# Altium project PCB_RX_V2.7.PrjPcb
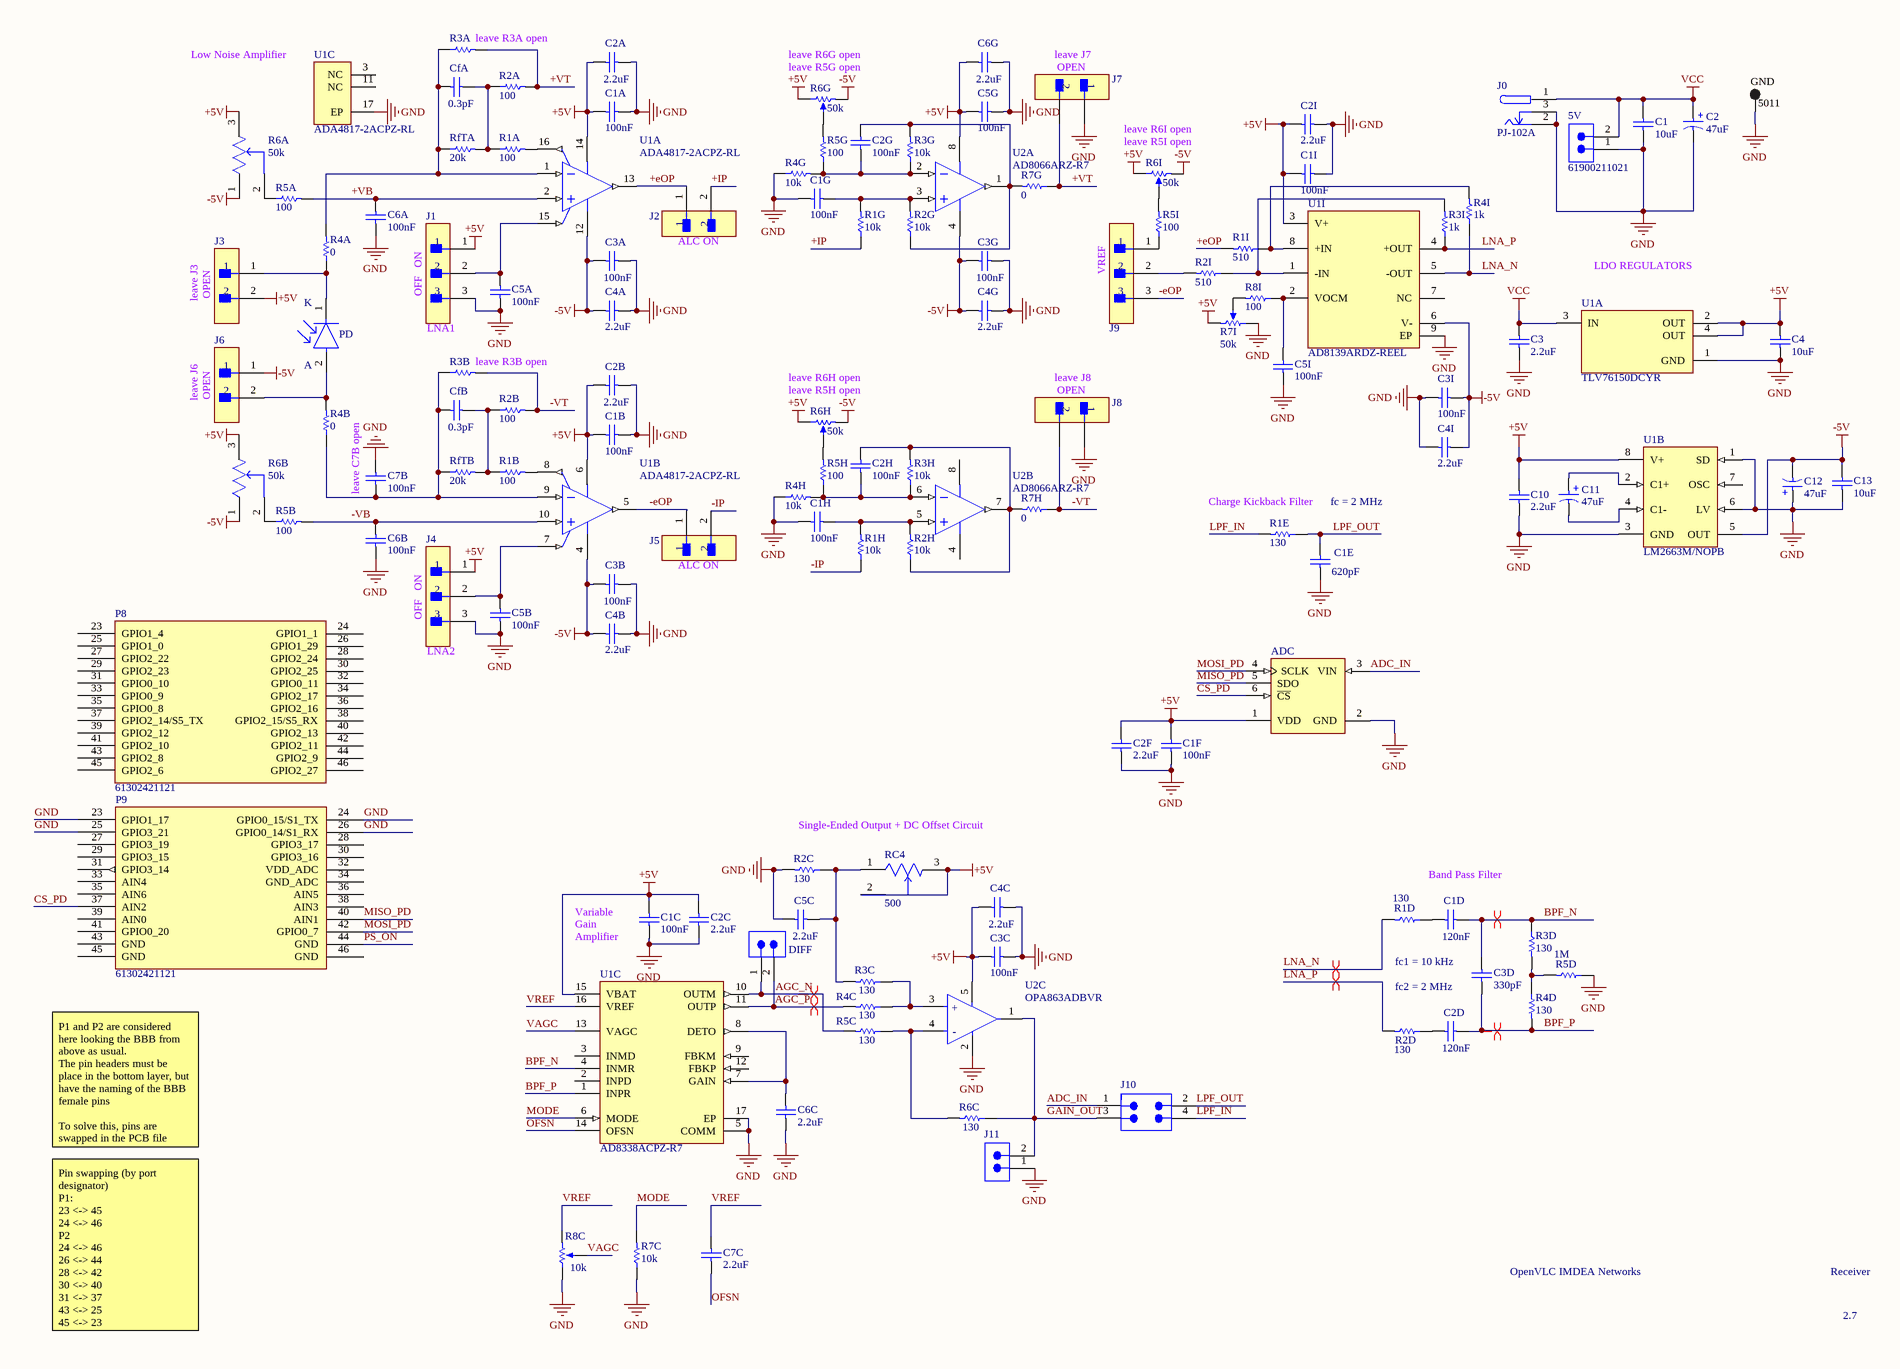
[diagram p0: PCB_RX.SchDoc, left]
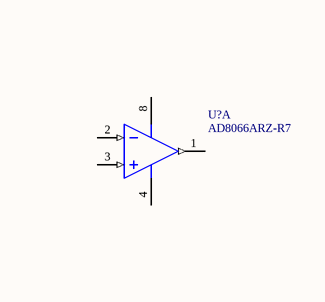
[diagram p1: PCB_RX.SchDoc, right]
1 sheet, 126 parts. Net scope: global (net labels, ports and power ports of the same name join across sheets).
Board file: PCB_RX.PcbDoc

## Sheet PCB_RX.SchDoc
size A3; SheetNumber: 1; SheetTotal: 1

### Parts
5V  61900211021  [61900211021]
ADC  ADS7886SBDBVR  [TI-DBV6_M]  (value not drawn)
C1  value 10uF  [RESC1608X55N]  (hidden comment: Cap)
C1A  value 100nF  [RESC1608X55N]  (hidden comment: Cap)
C1B  value 100nF  [RESC1608X55N]  (hidden comment: Cap)
C1C  value 100nF  [RESC1608X55N]  (hidden comment: Cap)
C1D  value 120nF  [RESC1608X55N]  (hidden comment: Cap)
C1E  value 620pF  [RESC1608X55N]  (hidden comment: Cap)
C1F  value 100nF  [RESC1608X55N]  (hidden comment: Cap)
C1G  value 100nF  [RESC1608X55N]  (hidden comment: Cap)
C1H  value 100nF  [RESC1608X55N]  (hidden comment: Cap)
C1I  value 100nF  [RESC1608X55N]  (hidden comment: Cap)
C2  47uF  [WCAP-PSLP_D5H5.5]
C2A  value 2.2uF  [RESC1608X55N]  (hidden comment: Cap)
C2B  value 2.2uF  [RESC1608X55N]  (hidden comment: Cap)
C2C  value 2.2uF  [RESC1608X55N]  (hidden comment: Cap)
C2D  value 120nF  [RESC1608X55N]  (hidden comment: Cap)
C2F  value 2.2uF  [RESC1608X55N]  (hidden comment: Cap)
C2G  value 100nF  [RESC1608X55N]  (hidden comment: Cap)
C2H  value 100nF  [RESC1608X55N]  (hidden comment: Cap)
C2I  value 2.2uF  [RESC1608X55N]  (hidden comment: Cap)
C3  value 2.2uF  [RESC1608X55N]  (hidden comment: Cap)
C3A  value 100nF  [RESC1608X55N]  (hidden comment: Cap)
C3B  value 100nF  [RESC1608X55N]  (hidden comment: Cap)
C3C  value 100nF  [RESC1608X55N]  (hidden comment: Cap)
C3D  value 330pF  [RESC1608X55N]  (hidden comment: Cap)
C3G  value 100nF  [RESC1608X55N]  (hidden comment: Cap)
C3I  value 100nF  [RESC1608X55N]  (hidden comment: Cap)
C4  value 10uF  [RESC1608X55N]  (hidden comment: Cap)
C4A  value 2.2uF  [RESC1608X55N]  (hidden comment: Cap)
C4B  value 2.2uF  [RESC1608X55N]  (hidden comment: Cap)
C4C  value 2.2uF  [RESC1608X55N]  (hidden comment: Cap)
C4G  value 2.2uF  [RESC1608X55N]  (hidden comment: Cap)
C4I  value 2.2uF  [RESC1608X55N]  (hidden comment: Cap)
C5A  value 100nF  [RESC1608X55N]  (hidden comment: Cap)
C5B  value 100nF  [RESC1608X55N]  (hidden comment: Cap)
C5C  value 2.2uF  [RESC1608X55N]  (hidden comment: Cap)
C5G  value 100nF  [RESC1608X55N]  (hidden comment: Cap)
C5I  value 100nF  [RESC1608X55N]  (hidden comment: Cap)
C6A  value 100nF  [RESC1608X55N]  (hidden comment: Cap)
C6B  value 100nF  [RESC1608X55N]  (hidden comment: Cap)
C6C  value 2.2uF  [RESC1608X55N]  (hidden comment: Cap)
C6G  value 2.2uF  [RESC1608X55N]  (hidden comment: Cap)
C7B  value 100nF  [RESC1608X55N]  (hidden comment: Cap)
C7C  value 2.2uF  [RESC1608X55N]  (hidden comment: Cap)
C10  value 2.2uF  [RESC1608X55N]  (hidden comment: Cap)
C11  47uF  [WCAP-PSLP_D5H5.5]
C12  47uF  [WCAP-PSLP_D5H5.5]
C13  value 10uF  [RESC1608X55N]  (hidden comment: Cap)
CfA  value 0.3pF  [RESC1608X55N]  (hidden comment: Cap)
CfB  value 0.3pF  [RESC1608X55N]  (hidden comment: Cap)
DIFF  61300211121  [61300211121]  (value not drawn)
GND  5011  [KSTN-5011_V]
J0  PJ-102A  [FP-PJ-102A-MFG]
J1  GRPB031VWVN-RC  [FP-TMS-103-02-G-S-MFG]  (value not drawn)
J2  GRPB021VWVN-RC  [FP-GRPB021VWVN-RC-MFG]  (value not drawn)
J3  GRPB021VWVN-RC  [FP-GRPB021VWVN-RC-MFG]  (value not drawn)
J4  GRPB031VWVN-RC  [FP-TMS-103-02-G-S-MFG]  (value not drawn)
J5  GRPB021VWVN-RC  [FP-GRPB021VWVN-RC-MFG]  (value not drawn)
J6  GRPB021VWVN-RC  [FP-GRPB021VWVN-RC-MFG]  (value not drawn)
J7  GRPB021VWVN-RC  [FP-GRPB021VWVN-RC-MFG]  (value not drawn)
J8  GRPB021VWVN-RC  [FP-GRPB021VWVN-RC-MFG]  (value not drawn)
J9  GRPB031VWVN-RC  [FP-TMS-103-02-G-S-MFG]  (value not drawn)
J10  61300421121  [61300421121]  (value not drawn)
J11  61900211121  [61900211121]  (value not drawn)
P8  61302421121  [BBB_CAPE_NO_HEADER_R_24]
P9  61302421121  [BBB_CAPE_NO_HEADER_R_24]
PD  SFH213  [FP-SFH213-0]  (value not drawn)
R1A  value 100  [RESC1608X55N]  (hidden comment: Res1)
R1B  value 100  [RESC1608X55N]  (hidden comment: Res1)
R1D  value 130  [RESC1608X55N]  (hidden comment: Res1)
R1E  value 130  [RESC1608X55N]  (hidden comment: Res1)
R1G  value 10k  [RESC1608X55N]  (hidden comment: Res1)
R1H  value 10k  [RESC1608X55N]  (hidden comment: Res1)
R1I  value 510  [RESC1608X55N]  (hidden comment: Res1)
R2A  value 100  [RESC1608X55N]  (hidden comment: Res1)
R2B  value 100  [RESC1608X55N]  (hidden comment: Res1)
R2C  value 130  [RESC1608X55N]  (hidden comment: Res1)
R2D  value 130  [RESC1608X55N]  (hidden comment: Res1)
R2G  value 10k  [RESC1608X55N]  (hidden comment: Res1)
R2H  value 10k  [RESC1608X55N]  (hidden comment: Res1)
R2I  value 510  [RESC1608X55N]  (hidden comment: Res1)
R3A  Res1  [RESC1608X55N]  (value not drawn)
R3B  Res1  [RESC1608X55N]  (value not drawn)
R3C  value 130  [RESC1608X55N]  (hidden comment: Res1)
R3D  value 130  [RESC1608X55N]  (hidden comment: 500)
R3G  value 10k  [RESC1608X55N]  (hidden comment: Res1)
R3H  value 10k  [RESC1608X55N]  (hidden comment: Res1)
R3I  value 1k  [RESC1608X55N]  (hidden comment: Res1)
R4A  value 0  [RESC1608X55N]  (hidden comment: Res1)
R4B  value 0  [RESC1608X55N]  (hidden comment: Res1)
R4C  value 130  [RESC1608X55N]  (hidden comment: Res1)
R4D  value 130  [RESC1608X55N]  (hidden comment: Res1)
R4G  value 10k  [RESC1608X55N]  (hidden comment: Res1)
R4H  value 10k  [RESC1608X55N]  (hidden comment: Res1)
R4I  value 1k  [RESC1608X55N]  (hidden comment: Res1)
R5A  value 100  [RESC1608X55N]  (hidden comment: Res1)
R5B  value 100  [RESC1608X55N]  (hidden comment: Res1)
R5C  value 130  [RESC1608X55N]  (hidden comment: Res1)
R5D  value 1M  [RESC1608X55N]  (hidden comment: Res1)
R5G  value 100  [RESC1608X55N]  (hidden comment: Res1)
R5H  value 100  [RESC1608X55N]  (hidden comment: Res1)
R5I  value 100  [RESC1608X55N]  (hidden comment: Res1)
R6A  50k  [FP-3296W-MFG]
R6B  50k  [FP-3296W-MFG]
R6C  value 130  [RESC1608X55N]  (hidden comment: Res1)
R6G  50k  [BOUR-3362P]
R6H  50k  [BOUR-3362P]
R6I  50k  [BOUR-3362P]
R7C  value 10k  [RESC1608X55N]  (hidden comment: Res1)
R7G  value 0  [RESC1608X55N]  (hidden comment: Res1)
R7H  value 0  [RESC1608X55N]  (hidden comment: Res1)
R7I  50k  [BOUR-3362P]
R8C  10k  [BOUR-3362P]
R8I  value 100  [RESC1608X55N]  (hidden comment: Res1)
RC4  500  [FP-3296W-MFG]
RfTA  value 20k  [RESC1608X55N]  (hidden comment: Res1)
RfTB  value 20k  [RESC1608X55N]  (hidden comment: Res1)
U1  ADA4817-2ACPZ-RL  [CP-16-4_N]  (parts A,B,C of 3)
U1A  TLV76150DCYR  [FP-DCY0004A-MFG]
U1B  LM2663M/NOPB  [D0008A_N]
U1C  AD8338ACPZ-R7  [FP-CP-16-22-IPC_A]
U1I  AD8139ARDZ-REEL  [FP-RD-8-1-IPC_C]
U2  AD8066ARZ-R7  [ADI-R-8_M]  (parts A,B of 2)
U2C  OPA863ADBVR  [FP-DBV0005A-MFG]
U?  AD8066ARZ-R7  [ADI-R-8_M]  (part A of 2)

### Nets
+5V: ADC.1(VDD) C1A.1 C1B.1 C1C.1 C1F.1 C1I.1 C2A.1 C2B.1 C2C.1 C2F.1 C2I.1 C3C.1 C4.2 C4C.1 C5G.1 C6G.1 C10.2 J1.1 J3.2 J4.1 R6A.3(CW) R6B.3(CW) R6G.1(CCW) R6H.1(CCW) R6I.1(CCW) R7I.3(CW) RC4.2(WIPER) RC4.3(CW) U1.6(+VS_2) U1.14(+VS_1) U1A.2(OUT) U1A.4(OUT) U1B.8(V+) U1C.15(VBAT) U1I.3(V+) U2.8(+VS) U2C.5(VS+)
-5V: C3A.1 C3B.1 C3G.1 C3I.2 C4A.1 C4B.1 C4G.1 C4I.2 C12.2(N) C13.2 J6.1 R6A.1(CCW) R6B.1(CCW) R6G.3(CW) R6H.3(CW) R6I.3(CW) U1.4(-VS_2) U1.12(-VS_1) U1B.5(OUT) U1I.6(V-) U2.4(-VS)
GND: 5V.1 ADC.2(GND) C1.2 C1A.2 C1B.2 C1C.2 C1E.2 C1F.2 C1G.1 C1H.1 C1I.2 C2.2(N) C2A.2 C2B.2 C2C.2 C2F.2 C2I.2 C3.1 C3A.2 C3B.2 C3C.2 C3G.2 C3I.1 C4.1 C4A.2 C4B.2 C4C.2 C4G.2 C4I.1 C5A.2 C5B.2 C5C.1 C5G.2 C5I.2 C6A.2 C6B.2 C6C.1 C6G.2 C7B.2 C10.1 C12.1(P) C13.1 GND.1 J0.2 J0.3 J1.3 J4.3 J7.1 J8.1 J11.1 P9.23(GPIO1_17) P9.24(GPIO0_15/S1_TX) P9.25(GPIO3_21) P9.26(GPIO0_14/S1_RX) R2C.2 R4G.1 R4H.1 R5D.1 R7C.1 R7I.1(CCW) R8C.1(CCW) U1A.1(GND) U1B.1(SD) U1B.3(GND) U1B.6(LV) U1C.5(COMM) U1C.17(EP) U1I.9(EP) U2C.2(VS-)
VCC: 5V.2 C1.1 C2.1(P) C3.2 J0.1 U1A.3(IN)
+eOP: J2.1 R1I.2 U1.13(OUT_1)
+IP: J2.2 R1G.1
+VB: C6A.1 R5A.2 U1.2(+IN_1)
+VT: J7.2 R2A.2 R3A.2 R7G.1
-eOP: J5.1 J9.3 U1.5(OUT_2)
-IP: J5.2 R1H.1
-VB: C6B.1 R5B.2 U1.10(+IN_2)
-VT: J8.2 R2B.2 R3B.2 R7H.1
ADC_IN: ADC.3(VIN) J10.1
AGC_N: DIFF.1 R5C.2 U1C.10(OUTM)
AGC_P: DIFF.2 R4C.2 U1C.11(OUTP)
BPF_N: C1D.2 C3D.2 R3D.1 U1C.4(INMR)
BPF_P: C2D.2 C3D.1 R4D.2 U1C.1(INPR)
CS_PD: ADC.6(~{CS}) P9.37(AIN2)
GAIN_OUT: J10.3 J11.2 R6C.1 U2C.1(VOUT)
LNA_N: R1D.2 R4I.1 U1I.5(-OUT)
LNA_P: R2D.2 R3I.1 U1I.4(+OUT)
LPF_IN: J10.4 R1E.2
LPF_OUT: C1E.1 J10.2 R1E.1
MISO_PD: ADC.5(SDO) P9.40(AIN1)
MODE: R7C.2 U1C.6(MODE)
MOSI_PD: ADC.4(SCLK) P9.42(GPIO0_7)
OFSN: C7C.1 U1C.14(OFSN)
PS_ON: P9.44(GND)
VAGC: R8C.2(S) U1C.13(VAGC)
VREF: C7C.2 R8C.3(CW) U1C.16(VREF)
NetC1D_1: C1D.1 R1D.1
NetC1G_2: C1G.2 R1G.2 R2G.2 U2.3(+IN_1)
NetC1H_2: C1H.2 R1H.2 R2H.2 U2.5(+IN_2)
NetC2D_1: C2D.1 R2D.1
NetC2G_1: C2G.1 R3G.1 R4G.2 R5G.1 U2.2(-IN_1)
NetC2G_2: C2G.2 R2G.1 R3G.2 R7G.2 U2.1(VOUT_1)
NetC2H_1: C2H.1 R3H.1 R4H.2 R5H.1 U2.6(-IN_2)
NetC2H_2: C2H.2 R2H.1 R3H.2 R7H.2 U2.7(VOUT_2)
NetC5A_1: C5A.1 J1.2 U1.15(~{PD1})
NetC5B_1: C5B.1 J4.2 U1.7(~{PD2})
NetC5C_2: C5C.2 R2C.1 R3C.2 RC4.1(CCW)
NetC5I_1: C5I.1 R8I.1 U1I.2(VOCM)
NetC6C_2: C6C.2 U1C.7(GAIN) U1C.8(DETO)
NetC7B_1: C7B.1 CfB.1 R3B.1 R4B.1 RfTB.1 U1.9(-IN_2)
NetC11_1: C11.1(P) U1B.2(C1+)
NetC11_2: C11.2(N) U1B.4(C1-)
NetCfA_1: CfA.1 R3A.1 R4A.2 RfTA.1 U1.1(-IN_1)
NetCfA_2: CfA.2 R1A.1 R2A.1 RfTA.2
NetCfB_2: CfB.2 R1B.1 R2B.1 RfTB.2
NetJ3_1: J3.1 PD.1(C) R4A.1
NetJ6_2: J6.2 PD.2(A) R4B.2
NetJ9_1: J9.1 R5I.1
NetJ9_2: J9.2 R2I.2
NetR1A_2: R1A.2 U1.16(FB1)
NetR1B_2: R1B.2 U1.8(FB2)
NetR1I_1: R1I.1 R4I.2 U1I.8(+IN)
NetR2I_1: R2I.1 R3I.2 U1I.1(-IN)
NetR3C_1: R3C.1 R4C.1 U2C.3(VIN+)
NetR3D_2: R3D.2 R4D.1 R5D.2
NetR5A_1: R5A.1 R6A.2(WIPER)
NetR5B_1: R5B.1 R6B.2(WIPER)
NetR5C_1: R5C.1 R6C.2 U2C.4(VIN-)
NetR5G_2: R5G.2 R6G.2(S)
NetR5H_2: R5H.2 R6H.2(S)
NetR5I_2: R5I.2 R6I.2(S)
NetR7I_2: R7I.2(S) R8I.2

Not connected (* = marked no-connect by the designer): P8 23(GPIO1_4) 24(GPIO1_1) 25(GPIO1_0) 26(GPIO1_29) 27(GPIO2_22) 28(GPIO2_24) 29(GPIO2_23) 30(GPIO2_25) 31(GPIO0_10) 32(GPIO0_11) 33(GPIO0_9) 34(GPIO2_17) 35(GPIO0_8) 36(GPIO2_16) 37(GPIO2_14/S5_TX) 38(GPIO2_15/S5_RX) 39(GPIO2_12) 40(GPIO2_13) 41(GPIO2_10) 42(GPIO2_11) 43(GPIO2_8) 44(GPIO2_9) 45(GPIO2_6) 46(GPIO2_27); P9 27(GPIO3_19) 28(GPIO3_17) 29(GPIO3_15) 30(GPIO3_16) 31(GPIO3_14) 32(VDD_ADC) 33(AIN4) 34(GND_ADC) 35(AIN6) 36(AIN5) 38(AIN3) 39(AIN0) 41(GPIO0_20) 43(GND) 45(GND) 46(GND); U1 3(NC) 11(NC) 17(EP); U1B 7(OSC); U1C 2(INPD) 3(INMD) 9(FBKM) 12(FBKP); U1I 7(NC); U? 1(VOUT_1) 2(-IN_1) 3(+IN_1) 4(-VS) 8(+VS)

### Layout directives
differential pair: AGC_N, AGC_P, BPF_N, BPF_P, LNA_N, LNA_P

### Notes on the sheet
- Low Noise Amplifier
- (near R3A) leave R3A open
- (near R6G) leave R5G open
- (near R6G) leave R6G open
- (near J7) leave J7
- (near J7) OPEN
- (near R6I) leave R5I open
- leave R6I open
- (near J1) ON
- (near J2) ALC ON
- (near J9) VREF
- LDO REGULATORS
- (near J3) leave J3
- (near J3) OPEN
- (near PD) K
- (near J1) OFF
- LNA1
- (near J6) leave J6
- (near J6) OPEN
- (near PD) A
- (near R3B) leave R3B open
- (near R6H) leave R5H open
- (near R6H) leave R6H open
- (near J8) leave J8
- (near J8) OPEN
- (near C7B) leave C7B open
- (near R1E) Charge Kickback Filter
- fc = 2 MHz
- (near J4) ON
- (near J5) ALC ON
- (near J4) OFF
- (near J4) LNA2
- Single-Ended Output + DC Offset Circuit
- Band Pass Filter
- (near C1C) Amplifier
- Gain
- (near C1C) Variable
- (near C3D) fc1 = 10 kHz
- fc2 = 2 MHz
- P1 and P2 are considered here looking the BBB from above as usual.
  The pin headers must be place in the bottom layer, but have the naming of the BBB female pins
  To solve this, pins are swapped in the PCB file
- OpenVLC IMDEA Networks
- Receiver
- Pin swapping (by port designator)
  P1:
  23 <-> 45
  24 <-> 46
  P2
  24 <-> 46
  26 <-> 44
  28 <-> 42
  30 <-> 40
  31 <-> 37
  43 <-> 25
  45 <-> 23
- 2.7
- Labels drawn without touching a wire or pin: GND
- (in symbol CMP-00370-145533195-1) +; -
- (in symbol CMP-03913-53758736-1) +

### Library data of the parts
5V = CMP-1502-00592-2: NexarPartId: 18818217; Gender: Male; Insulation Resistance: 1GΩ; Voltage Rating: 250V; Contact Resistance: 20mΩ; Connector Type: Male Pin; Number of Positions: 2; Insulation: Insulated; Current Rating: 3A; Pitch: 2.54mm; Contact Mating Length: 7.62mm; Packaging: Bulk; Contact Plating: Tin; REACH SVHC: Unknown; Height: 3.2mm; Lead Pitch: 2.54mm; Color: Beige; Flammability Rating: UL94 V-0; RoHS: Compliant; Operating Supply Voltage: 250V; Length: 5.08mm; Number of Pins: 2; Max Operating Temperature: 105°C; Number of Rows: 1; Min Operating Temperature: -40°C; Contact Material: Copper; Mount: Through Hole; Housing Material: Nylon; Width: 5.12mm; Fastening Type: Friction; Contact Gender: Male; Number of Contacts: 2; Termination: Through Hole
ADC = CMP-0003-00246-2: 2.35 to 5.25 V, 12-Bit, 1 MSPS, Serial ADC, -40 to 125 degC, 6-pin SOT23 (DBV6), Green (RoHS & no Sb/Br); Manufacturer: Texas Instruments; Sample Rate (max)(SPS): 1M; INL(Max)(+/-LSB): 1.25; Digital Supply(Min)(V): 2.35; SNR(dB): 71.25; Interface: Serial SPI; Resolution(Bits): 12; SubFamily: Precision ADC (<=10MSPS); # Input Channels: 1; Digital Supply(Max)(V): 5.25; SFDR(dB): 85.5; Architecture: SAR; PackageDescription: 6-Pin Plastic Small Outline, Body 1.6 x 2.9 mm, Pitch 0.95 mm; ComponentLink1URL: http://www.ti.com/; PackageReference: DBV6; PartNumber: ADS7886SBDBVR; ComponentLink1Description: Manufacturer URL; ComponentLink2Description: Datasheet; Code_JEDEC: MO-178; ComponentLink3URL: http://www.ti.com/litv/pdf/mpds026h; ComponentLink2URL: http://www.ti.com/general/docs/lit/getliterature.tsp?genericPartNumber=ADS7886&fileType=pdf; ComponentLink3Description: Package Specification; Eco-Plan: Green (RoHS & no Sb/Br); Analog Voltage AV/DD(Min)(V): 2.35; DatasheetVersion: SLAS492A; SINAD(dB): 71.25; Mounting Technology: Surface Mount; PackageVersion: 4073253-5/K, 03/2006; Analog Voltage AV/DD(Max)(V): 5.25
C1 C1A C1B C1C C1D C1E C1F C1G C1H C1I C2A C2B C2C C2D C2F C2G C2H C2I C3 C3A C3B C3C C3D C3G C3I C4 C4A C4B C4C C4G C4I C5A C5B C5C C5G C5I C6A C6B C6C C6G C7B C7C C10 C13 CfA CfB = Cap: Capacitor; Published: 8-Jun-2000; LatestRevisionDate: 17-Jul-2002; LatestRevisionNote: Re-released for DXP Platform.; PackageReference: RAD-0.3; Publisher: Altium Limited; PackageDescription: Radial Cap, Thru-Hole; 2 Leads; 0.3 in Pin Spacing
C2 C11 C12 = CMP-03913-53758736-1: 875105242006 WCAP-PSLP Aluminum Polymer Capacitors; Voltage Rating (DC): 10V; Life (Hours): 2000hours; ESR (Equivalent Series Resistance): 30mΩ; Ripple Current: 1.97A; Leakage Current: 300µA; Capacitance: 47µF; Polarity: Polar; Pitch: 5.3mm; Tolerance: 20%; Diameter: 5mm; Length: 5.5mm; RoHS: Compliant; Packaging: Tape & Reel (TR); Case/Package: Radial; REACH SVHC: Unknown; Max Operating Temperature: 105°C; Min Operating Temperature: -55°C; Mount: Surface Mount; Voltage Rating: 10V; Height - Seated (Max): 5.5118mm; NexarPartId: 53758736
DIFF = CMP-1712-00002-6: NexarPartId: 20081794; Number of Contacts: 2; Pitch: 2.54mm; Connector Type: Male Pin; Voltage Rating: 250V; Current Rating: 3A; Gender: Male; Contact Resistance: 20mΩ; Height: 8.94mm; Lead Free: Lead Free; Number of Pins: 2; Termination: Through Hole; RoHS: Compliant; Lead Pitch: 2.54mm; REACH SVHC: No SVHC; Housing Material: PBT; Contact Mating Length: 5.9944mm; Min Operating Temperature: -40°C; Orientation: Vertical; Contact Material: Copper; Contact Gender: Male; Max Operating Temperature: 125°C; Number of Rows: 1; Number of Positions: 2; Packaging: Bulk; Contact Plating: Gold; Mount: Through Hole; Color: Black; Operating Supply Voltage: 250V
GND = CMP-1672-00003-4: Test Point, Black, Through Hole, RoHS, Bulk; Manufacturer: Keystone; ComponentLink2URL: http://www.keyelco.com/product-pdf.cfm?p=1320; Colour: Black; Pins: 1; REACH SVHC: No SVHC; ComponentLink1URL: http://www.keyelco.com/; PackageReference: 5011; Contact Plating: Silver; Package Quantity: 100; Packaging: Bulk; RoHSCompliant: true; Height: 8.12 mm; PackageDescription: 1-Pin Through Hole Device, Dia 3.17 mm; Mount: Through Hole; Mounting Technology: Through Hole; DatasheetVersion: Rev. F, 12/2013; ComponentLink1Description: Manufacturer URL; Contact Material: Bronze; ComponentLink2Description: Datasheet
J0 = CMP-12637-106234071-1: PJ-102A 2.0 x 6.5 mm, 2.5 A, Horizontal, Through Hole, Tapered Pins, Dc Power Jack Connector; Voltage Rating (DC): 24V; Number of Contacts: 3; Outside Diameter: 6.5mm; Gender: Male; Shielding: No; Insulation Resistance: 50MΩ; Current Rating: 2.5A; Inside Diameter: 2mm; Number of Conductors: 2; Housing Color: Black; RoHS: Compliant; Diameter: 2.1mm; Mount: Through Hole; Contact Plating: Nickel; NexarPartId: 106234071; Voltage Rating: 24V; Housing Material: Thermoplastic; Max Operating Temperature: 85°C; Color: Black; Contact Material: Copper, Nickel, Tin; Orientation: Horizontal; Packaging: Bulk; Flammability Rating: UL94 V-0; Schedule B: 8536695050, 8536695050; Contact Gender: Male; Lead Free: Lead Free; Termination: Through Hole; Min Operating Temperature: -25°C; Height: 11.2mm; Lifecycle Status: Production
J1 J4 J9 = CMP-02766-001782-1: CONN HEADER VERT 3POS 1.27MM; Number of Positions: 3; Max Current Rating: 1A; Gender: Male; Min Operating Temperature: -55°C; Housing Material: Polymer; Reach SVHC Compliant: Yes; Length: 3.81mm; Contact Material: Bronze; Series: TMS; Packaging: Bulk; Radiation Hardening: No; Insulation Material: Polymer; Contact Type: Male Pin; Orientation: Straight; Housing Color: Black; Contact Finish - Mating: GOLD; Contact Plating: Gold; Flammability Rating: UL94 V-0; Contact Shape: Square; Depth: 2.48mm; Pitch: 1.27mm; Fastening Type: Pull; RoHS Compliant: Yes; Termination: Solder; Number of Rows: 1; Insulation Color: Black; Number of Contacts: 3; Connector Type: Header; Max Operating Temperature: 125°C
J2 J3 J5-J8 = CMP-2000-06371-2: CONN HEADER VERT 2POS 1.27MM; Number of Positions: 2; Connector Type: Male Pin; Pitch: 0.05inch; Contact Plating: Gold; Lead Free: Lead Free; Termination: Solder; Packaging: Bulk; RoHS Compliant: Yes; Contact Type: Male Pin; Mount: Through Hole; Number of Rows: 1; Contact Mating Length: 0.118inch; Package Quantity: 1
J10 = CMP-1502-01066-4: NexarPartId: 32855524; Number of Positions: 4; Operating Supply Voltage: 250V; Pitch: 2.54mm; Connector Type: Male Pin; Current Rating: 3A; Contact Resistance: 20mΩ; Gender: Male; Number of Pins: 4; Max Operating Temperature: 105°C; Number of Contacts: 4; Contact Mating Length: 5.9944mm; Min Operating Temperature: -40°C; Orientation: Vertical; Height: 8.89mm; Mount: Through Hole; Lead Pitch: 2.54mm; Contact Material: Copper; Color: Black; Voltage Rating: 250V; RoHS: Compliant; Termination: Solder; Row Spacing: 2.54mm; Contact Plating: Gold; Number of Rows: 2; Lead Free: Lead Free; REACH SVHC: Unknown; Packaging: Bulk
J11 = CMP-1502-00584-3: NexarPartId: 18818218; Gender: Male; Connector Type: Male Pin; Insulation Resistance: 1GΩ; Contact Resistance: 20mΩ; Number of Contacts: 2; Operating Supply Voltage: 250V; Current Rating: 3A; Pitch: 2.54mm; Color: Beige; Fastening Type: Friction; Number of Pins: 2; Lead Pitch: 2.54mm; Orientation: Vertical; Max Operating Temperature: 105°C; Contact Mating Length: 7.493mm; RoHS: Compliant; Voltage Rating: 250V; Number of Positions: 2; Mount: Through Hole; Length: 5.08mm; Contact Plating: Tin; Width: 5.12mm; Termination: Through Hole; Flammability Rating: UL94 V-0; Min Operating Temperature: -40°C; Housing Material: Nylon; Contact Gender: Male; Number of Rows: 1; Packaging: Bulk; REACH SVHC: Unknown; Contact Material: Copper; Height: 11.75mm
P8 = BBB_P8_reduced
P9 = BBB_P9_reduced
PD = CMP-62027-000002-1: SENSOR PHOTODIODE 850NM RADIAL; Manufacturer: OSRAM; Reverse Breakdown Voltage: 20V; Dark Current: 0.001uA; Wavelength: 400-1100nm; Forward Voltage: 1.3V; Forward Current: 100mA; Voltage: 50V; Power Dissipation: 150mW; Category: Diode; Temperature Range High: +100°C; Digikey Description: SENSOR PHOTODIODE 850NM RADIAL; Lead Free: Yes; Automotive: No; Temperature: -40°C to +100°C; Device Class L1: Sensors; Package: SFH213; Device Class L3: Photodiodes; Mouser Description: Photodiode PIN Chip 850nm 0.62A/W Sensitivity 2-Pin T-1 3/4 T/R; Manufacturer Part Number: SFH213; Ipc Land Pattern Name: CAPRD254W95D570H860; Temperature Range Low: -40°C; Device Class L2: Optical Sensors; ComponentLink2URL: https://dammedia.osram.info/media/resource/hires/osram-dam-5488355/SFH%20213_EN.pdf; Sensor Output: Photodiode; Octopart: https://octopart.com/sfh+213-osram+opto-55410864; RoHS: TRUE; ComponentLink2Description: Datasheet
R1A R1B R1D R1E R1G R1H R1I R2A R2B R2C R2D R2G R2H R2I R3C R3D R3G R3H R3I R4A R4B R4C R4D R4G R4H R4I R5A R5B R5C R5D R5G R5H R5I R6C R7C R7G R7H R8I RfTA RfTB = Res1: Resistor; Published: 8-Jun-2000; LatestRevisionDate: 17-Jul-2002; LatestRevisionNote: Re-released for DXP Platform.; PackageReference: AXIAL-0.3; Publisher: Altium Limited; PackageDescription: Axial Device, Thru-Hole; 2 Leads; 0.3 in Pin Spacing
R3A R3B = Res1: Resistor; Value: 100; Published: 8-Jun-2000; LatestRevisionDate: 17-Jul-2002; LatestRevisionNote: Re-released for DXP Platform.; PackageReference: AXIAL-0.3; Publisher: Altium Limited; PackageDescription: Axial Device, Thru-Hole; 2 Leads; 0.3 in Pin Spacing
R6A R6B RC4 = CMP-2000-05583-2: TRIMMER 500K OHM 0.5W PC PIN TOP; Manufacturer: Bourns; Manufacturer Part Number: 3296W-1-504LF; Resistance: 500kΩ; Temperature Coefficient: 100ppm/°C; Value: 500kΩ; Tolerance: 10%; Voltage Rating: 300V; Standoff Height: 0.38mm; ComponentLink2Description: Datasheet; Package: 3296W; Series: Trimpot 3296-Sealed; Lead Free: Yes; Octopart: https://octopart.com/3296w-1-504lf-bourns-143884; Device Class L2: Resistors; Automotive: No; RoHS: TRUE; Temperature Range High: +125°C; Height: 12.05mm; Power Rating: 0.5W; Temperature Range Low: -55°C; ComponentLink2URL: https://www.bourns.com/docs/Product-Datasheets/3296.pdf; Device Class L1: Passive Components; Device Class L3: Variable Resistors and Potentiometers; Category: Res; Temperature: -55°C to +125°C; Digikey Description: TRIMMER 500K OHM 0.5W PC PIN TOP; Mouser Description: Trimmer; Cermet; Rest 500 Kilohms; PCB; 25 Turns; Pwr-Rtg 0.5W
R6G R6H R6I R7I R8C = CMP-1747-00004-1: Square Trimpot(R) Trimming Potentiometer, 10 KOhm, 300 V, -55 to 125 degC, 3-Pin THD, RoHS, Tube; Voltage Rating: 220 mV; Power Rating: 1 W; Tolerance: 1%; Resistance: 50 mohm; Case/Package: 1206; Length: 3.2 mm; RoHSCompliant: True; PackageDescription: 3-Pin Through Hole Device, Body 6.6 x 6.99 mm, Pitch 2.54 mm; ComponentLink2Description: Datasheet; REACH SVHC: No SVHC; Mount: Surface Mount; Height: 0.6 mm; Packaging: Tape and Reel; ComponentLink1URL: http://www.bourns.com/; Case Code (Imperial): 0612; Pins: 2; Case Code (Metric): 1632; ComponentLink2URL: http://www.bourns.com/docs/Product-Datasheets/3362.pdf; Min Operating Temperature: -25degC; ComponentLink1Description: Manufacturer URL; PackageReference: 3326P; Max Operating Temperature: 125degC; Width: 1.6 mm; Package Quantity: 5000; DatasheetVersion: May-16
U1 = CMP-0384-02093-2: Double Channel Low Noise Operational Amplifier, 1.05 GHz BW, 870 V/us SR, Industrial, 16-pin QFN (CP-16-4), Reel; Manufacturer: Analog Devices; Input Offset Voltage: 2mV; Iq/Amp: 21mA; Input Bias Current: 2pA; V Span Min: 5V; V Span Max: 10V; Amplifiers Per Package: 2; ComponentLink3Description: Package Specification; Mounting Technology: Surface Mount; Code_JEDEC: MO-220-VGGC; ComponentLink1URL: http://www.analog.com/en/index.html; PackageDescription: 16-Pin Lead Frame Chip Scale Package, Body 4 x 4 mm, Pitch 0.65 mm; ComponentLink4Description: Reference Circuit; ComponentLink1Description: Manufacturer URL; Generic Part Number: ADA4817-2; Small Signal Bandwidth: 1.05GHz; ComponentLink2URL: http://www.analog.com/static/imported-files/data_sheets/ADA4817-1_4817-2.pdf; ComponentLink3URL: http://www.analog.com/static/imported-files/packages/46009454504174339653421710019CP_16_4.pdf; Slew Rate: 870V/us; ComponentLink2Description: Datasheet; ComponentLink4URL: http://www.analog.com/en/all-operational-amplifiers-op-amps/operational-amplifiers-op-amps/ada4817-2/products/product.html#product-recommendations; PackageVersion: 010606-0; DatasheetVersion: Rev. A; PartNumber: ADA4817-2ACPZ-RL; PackageReference: CP-16-4; RevisionNote: Reference Circuit URL fixed
U1A = CMP-00370-134324849-1: TLV76150DCYR 1-A 16-V high-PSRR linear voltage regulator 4-SOT-223 -40 to 125; Manufacturer Lifecycle Status: ACTIVE; Number of Channels: 1; Min Supply Voltage: 6.5V; Nominal Supply Current: 65µA; Dropout Voltage: 900mV; Accuracy: 1%; Max Supply Voltage: 16V; Max Junction Temperature (Tj): 125°C; Output Current: 1A; Output Voltage: 5V; Width: 3.5mm; Length: 6.5mm; NexarPartId: 134324849; Max Operating Temperature: 125°C; Thickness: 1.6mm; Min Operating Temperature: -40°C; Case/Package: SOT-223; Height: 1.8mm; Lifecycle Status: Production; Number of Pins: 4; Number of Outputs: 1
U1B = CMP-0065-00037-3: Switched Capacitor Voltage Converter, 8-pin Narrow SOIC, Pb-Free; Manufacturer: Texas Instruments; PackageTopMarking: NSZXTT*LM26*63M; CompType: Switch Caps; PowerWise: N; Code_IPC: SOIC127P600-8; PinCount: 8; ComponentLink1Description: Datasheet URL; PackageReference: D0008A; Code_JEDEC: MS-012-AA; PackageDescription: SOIC Narrow, 4.9 x 3.9 x 1.45mm, 8 Lead, 1.27mm Pitch; ComponentLink1URL: http://www.ti.com/general/docs/lit/getliterature.tsp?genericPartNumber=LM2663&fileType=pdf; RoHS: Y
U1C = CMP-09116-000032-1: IC OPAMP VGA 1 CIRCUIT 16LFCSP; Manufacturer: Analog Devices; Nominal Supply Current: 3-6mA; Max Supply Voltage: 5V; Number Of Channels: 1; Output Current Per Channel: 5mA; Max Junction Temp: +150°C; Min Supply Voltage: 3V; Bandwidth: 18MHz; Voltage Gain: 80dB; Mouser Description: Special Purpose Amplifiers Ultra Low Pwr 18MHz SGL CH VGA; Device Class L2: Linear ICs; Ipc Land Pattern Name: QFN50P300X300X75-16; Temperature Range Low: -40°C; Device Class L1: Integrated Circuits (ICs); RoHS: TRUE; Digikey Description: IC OPAMP VGA 1 CIRCUIT 16LFCSP; Category: IC; ComponentLink2URL: https://www.analog.com/media/en/technical-documentation/data-sheets/AD8338.pdf; Automotive: No; Height: 0.8mm; Manufacturer Part Number: AD8338ACPZ-R7; Octopart: https://octopart.com/ad8338acpz-r7-analog+devices-21054770; Temperature: -40°C to +85°C; ComponentLink2Description: Datasheet; Lead Free: Yes; Temperature Range High: +85°C; Package: CP-16-22; Device Class L3: Amplifiers - Op Amps
U1I = CMP-09114-000114-1: IC OPAMP DIFF 1 CIRCUIT 8SOIC; -3db Bandwidth: 410MHz; Number of Circuits: 1; Slew Rate: 800V/µs; Operating Supply Current: 24.5mA; Min Dual Supply Voltage: 2.25V; Input Offset Voltage (Vos): 500uV; Input Bias Current: 7.5uA; Amplifier Type: DIFFERENTIAL; Max Dual Supply Voltage: 6V; Max Supply Voltage: 12V; Min Supply Voltage: 4.5V; Voltage Gain: 0.009dB; Common Mode Rejection Ratio: 75dB; Input Resistance: 1.5MR; Output Current per Channel: 100mA; Power Supply Rejection Ratio (PSRR): 92dB; RoHS Compliant: Yes; Number of Elements: 1; Mount: Surface Mount; Gain Bandwidth Product: 410MHz; Number of Channels: 1; Lead Free: Contains Lead; Packaging: Tape and Reel; Min Operating Temperature: -40°C; Contact Plating: Tin; Package Quantity: 2500; Number of Pins: 8; Weight: 0.019048oz; Series: -; Case/Package: SOIC; Max Operating Temperature: 125°C
U2 U? = CMP-0384-01346-2: Double Channel Low Power Operational Amplifier, 145 MHz BW, 180 V/us SR, Industrial, 8-pin SOIC (R-8), Reel; Manufacturer: Analog Devices; Generic Part Number: AD8066; Small Signal Bandwidth: 145MHz; V Span Min: 5V; Input Offset Voltage: 400uV; V Span Max: 24V; Input Bias Current: 2pA; Amplifiers Per Package: 2; Iq/Amp: 7.4mA; ComponentLink1URL: http://www.analog.com/en/index.html; ComponentLink4Description: Reference Circuit; ComponentLink3URL: http://www.analog.com/static/imported-files/packages/PKG_PDF/SOIC_Narrow%20(R)/R_8.pdf; Code_JEDEC: MS-012-AA; ComponentLink3Description: Package Specification; ComponentLink4URL: http://www.analog.com/en/all-operational-amplifiers-op-amps/operational-amplifiers-op-amps/ad8066/products/product.html#product-recommendations; RevisionNote: Reference Circuit URL fixed; ComponentLink1Description: Manufacturer URL; PackageDescription: 8-Pin Standard Small Outline Package, Body 3.9 x 4.9 mm, Pitch 1.27 mm; PackageReference: R-8; Slew Rate: 180V/us; PackageVersion: 060506-A; Mounting Technology: Surface Mount; ComponentLink2Description: Datasheet; ComponentLink2URL: http://www.analog.com/static/imported-files/data_sheets/AD8065_8066.pdf; PartNumber: AD8066ARZ-R7; DatasheetVersion: Rev. J
U2C = CMP-00370-145533195-1: OPA863ADBVR Single-channel, high-precision, low-power, 105-MHz, 12-V RRIO voltage-feedback amplifier 5-SOT-23 -40 to 125; Manufacturer Lifecycle Status: ACTIVE; Min Supply Voltage: 2.7V; Response Time: 70ns; Voltage Gain: 128dB; Input Offset Voltage (Vos): 10µV; Output Current per Channel: 30mA; Max Supply Voltage: 12.6V; Number of Channels: 1; Input Bias Current: 300nA; Nominal Supply Current: 800µA; Max Junction Temperature (Tj): 150°C; Bandwidth: 105MHz; Max Operating Temperature: 125°C; Length: 2.9mm; Ambient Temperature Range High: 125°C; Lifecycle Status: Production; Min Operating Temperature: -40°C; Thickness: 1.2mm; Case/Package: SOT-23; NexarPartId: 145533195; Height: 1.45mm; Number of Pins: 5; Width: 1.6mm